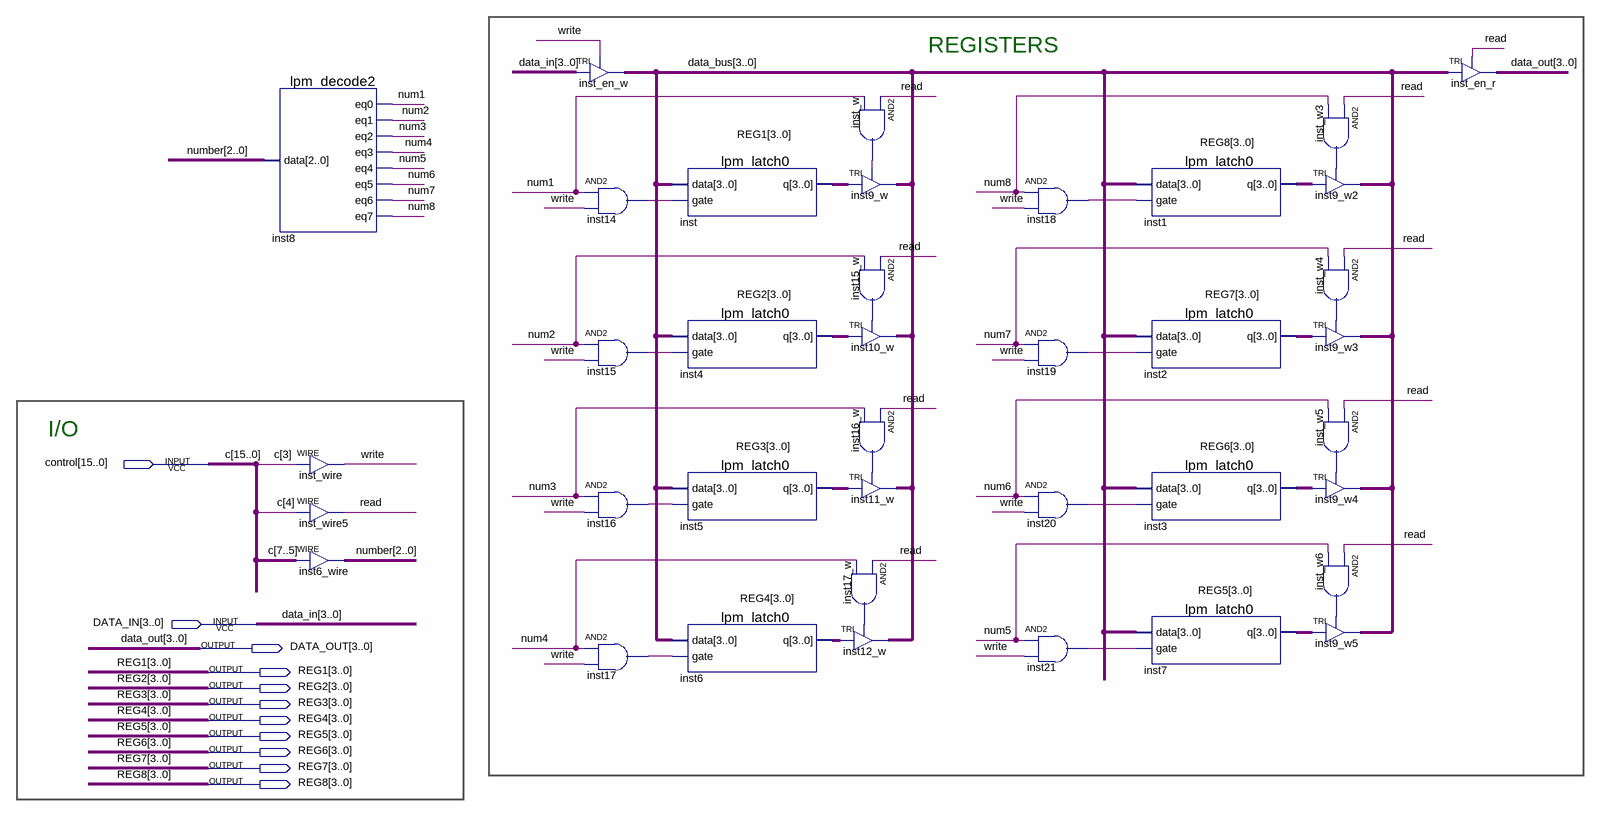
[diagram p0: schematic sheet]
// Quartus schematic Register_block.bdf as structural Verilog: 38 symbols, 11 pins
module Register_block (
  input  [15:0] control,
  input  [3:0] DATA_IN,
  output [3:0] DATA_OUT,
  output [3:0] REG1,
  output [3:0] REG2,
  output [3:0] REG3,
  output [3:0] REG4,
  output [3:0] REG5,
  output [3:0] REG6,
  output [3:0] REG7,
  output [3:0] REG8
);

  wire inst14_out, inst15_out, inst15_w_out, inst16_out, inst16_w_out, inst17_out, inst17_w_out, inst18_out,
       inst19_out, inst20_out, inst21_out, inst_w3_out, inst_w4_out, inst_w5_out, inst_w6_out, inst_w_out,
       num1, num2, num3, num4, num5, num6, num7, num8, read, write;
  wire [2:0] number;
  wire [3:0] data_bus;

  lpm_decode2 inst8 (
    .data(number), .eq0(num1), .eq1(num2), .eq2(num3), .eq3(num4), .eq4(num5), .eq5(num6), .eq6(num7),
    .eq7(num8));
  assign write = control[3];  // WIRE inst_wire
  assign read = control[4];  // WIRE inst_wire5
  assign number = control[7:5];  // WIRE inst6_wire
  TRI inst_en_w[3:0] (.IN(DATA_IN), .OE(write), .OUT(data_bus));
  and inst14 (inst14_out, num1, write);
  and inst15 (inst15_out, num2, write);
  and inst16 (inst16_out, num3, write);
  and inst17 (inst17_out, num4, write);
  lpm_latch0 inst (.data(data_bus), .gate(inst14_out), .q(REG1));
  lpm_latch0 inst4 (.data(data_bus), .gate(inst15_out), .q(REG2));
  lpm_latch0 inst5 (.data(data_bus), .gate(inst16_out), .q(REG3));
  lpm_latch0 inst6 (.data(data_bus), .gate(inst17_out), .q(REG4));
  and inst_w (inst_w_out, read, num1);
  TRI inst9_w[3:0] (.IN(REG1), .OE(inst_w_out), .OUT(data_bus));
  and inst15_w (inst15_w_out, read, num2);
  TRI inst10_w[3:0] (.IN(REG2), .OE(inst15_w_out), .OUT(data_bus));
  and inst16_w (inst16_w_out, read, num3);
  TRI inst11_w[3:0] (.IN(REG3), .OE(inst16_w_out), .OUT(data_bus));
  and inst17_w (inst17_w_out, read, num4);
  TRI inst12_w[3:0] (.IN(REG4), .OE(inst17_w_out), .OUT(data_bus));
  and inst18 (inst18_out, num8, write);
  and inst19 (inst19_out, num7, write);
  and inst20 (inst20_out, num6, write);
  and inst21 (inst21_out, num5, write);
  lpm_latch0 inst1 (.data(data_bus), .gate(inst18_out), .q(REG8));
  lpm_latch0 inst2 (.data(data_bus), .gate(inst19_out), .q(REG7));
  lpm_latch0 inst3 (.data(data_bus), .gate(inst20_out), .q(REG6));
  lpm_latch0 inst7 (.data(data_bus), .gate(inst21_out), .q(REG5));
  and inst_w3 (inst_w3_out, read, num8);
  TRI inst9_w2[3:0] (.IN(REG8), .OE(inst_w3_out), .OUT(data_bus));
  and inst_w4 (inst_w4_out, read, num7);
  TRI inst9_w3[3:0] (.IN(REG7), .OE(inst_w4_out), .OUT(data_bus));
  and inst_w5 (inst_w5_out, read, num6);
  TRI inst9_w4[3:0] (.IN(REG6), .OE(inst_w5_out), .OUT(data_bus));
  and inst_w6 (inst_w6_out, read, num5);
  TRI inst9_w5[3:0] (.IN(REG5), .OE(inst_w6_out), .OUT(data_bus));
  TRI inst_en_r[3:0] (.IN(data_bus), .OE(read), .OUT(DATA_OUT));

  // Other names for the same wires on the sheet: c[15:0] = control

  // Notes on the sheet:
  //   REGISTERS
  //   I/O
endmodule
